# EAGLE design demux (EAGLE 9.4.2)
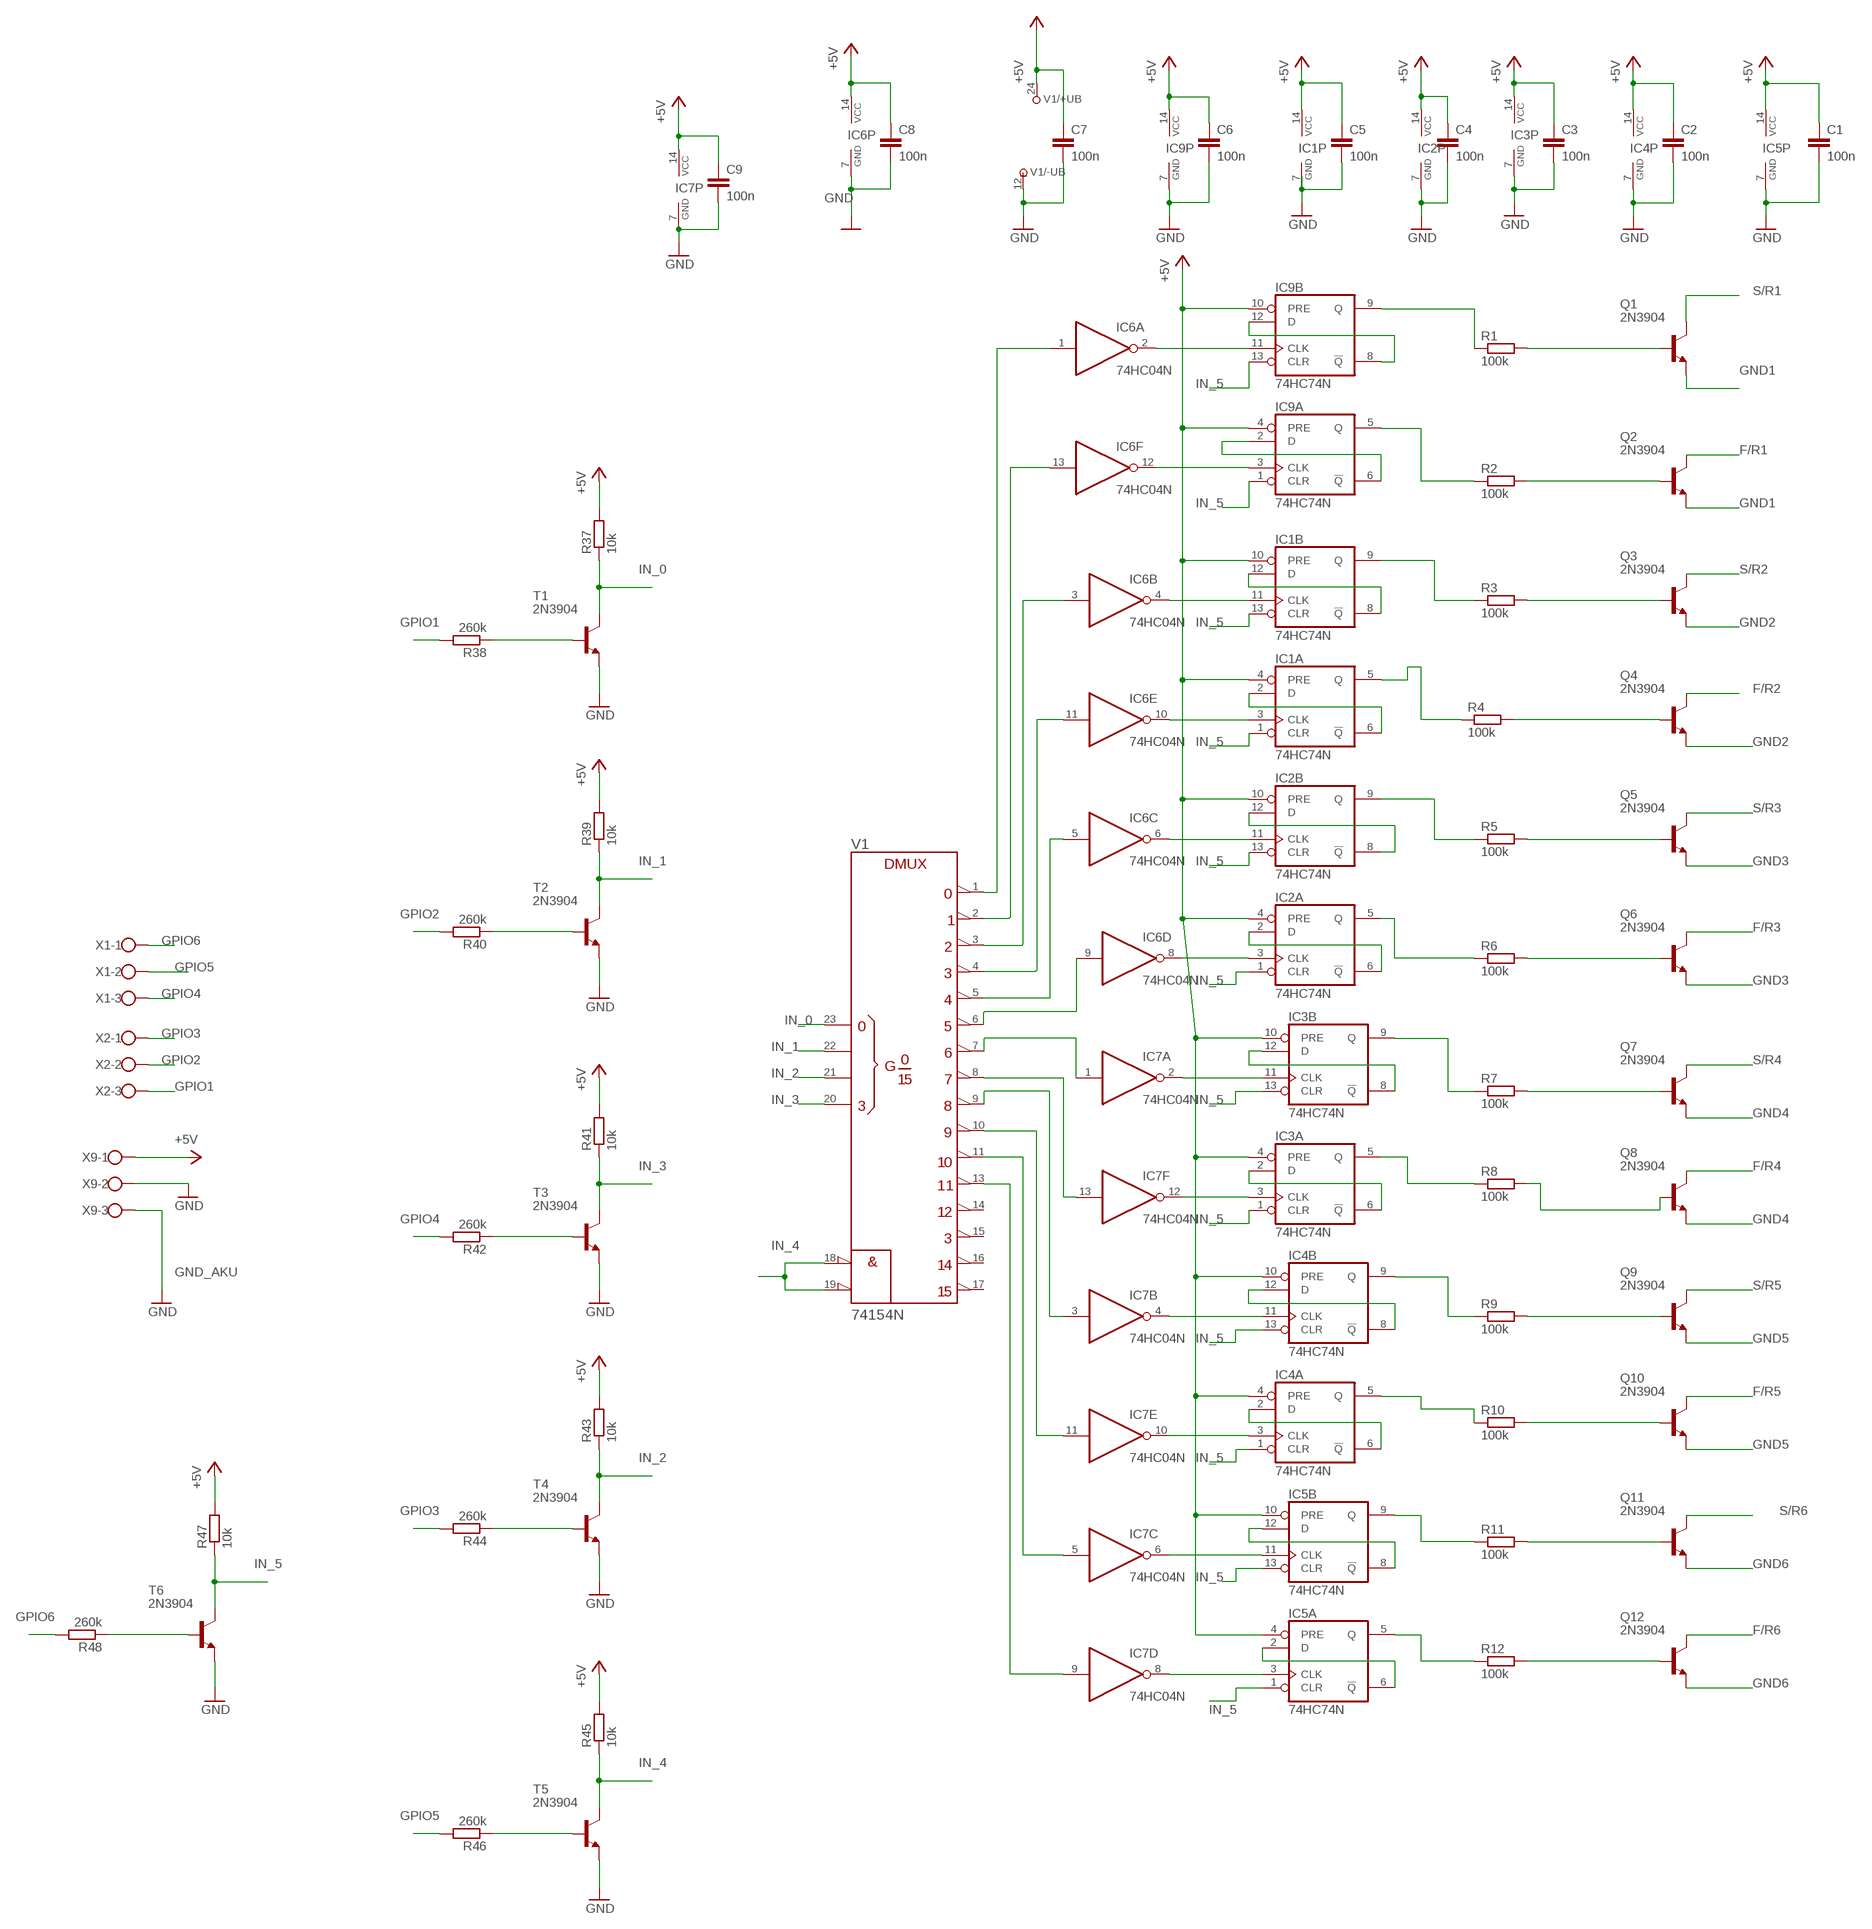
[diagram p0: schematic, sheet 1, part 1 of 2]
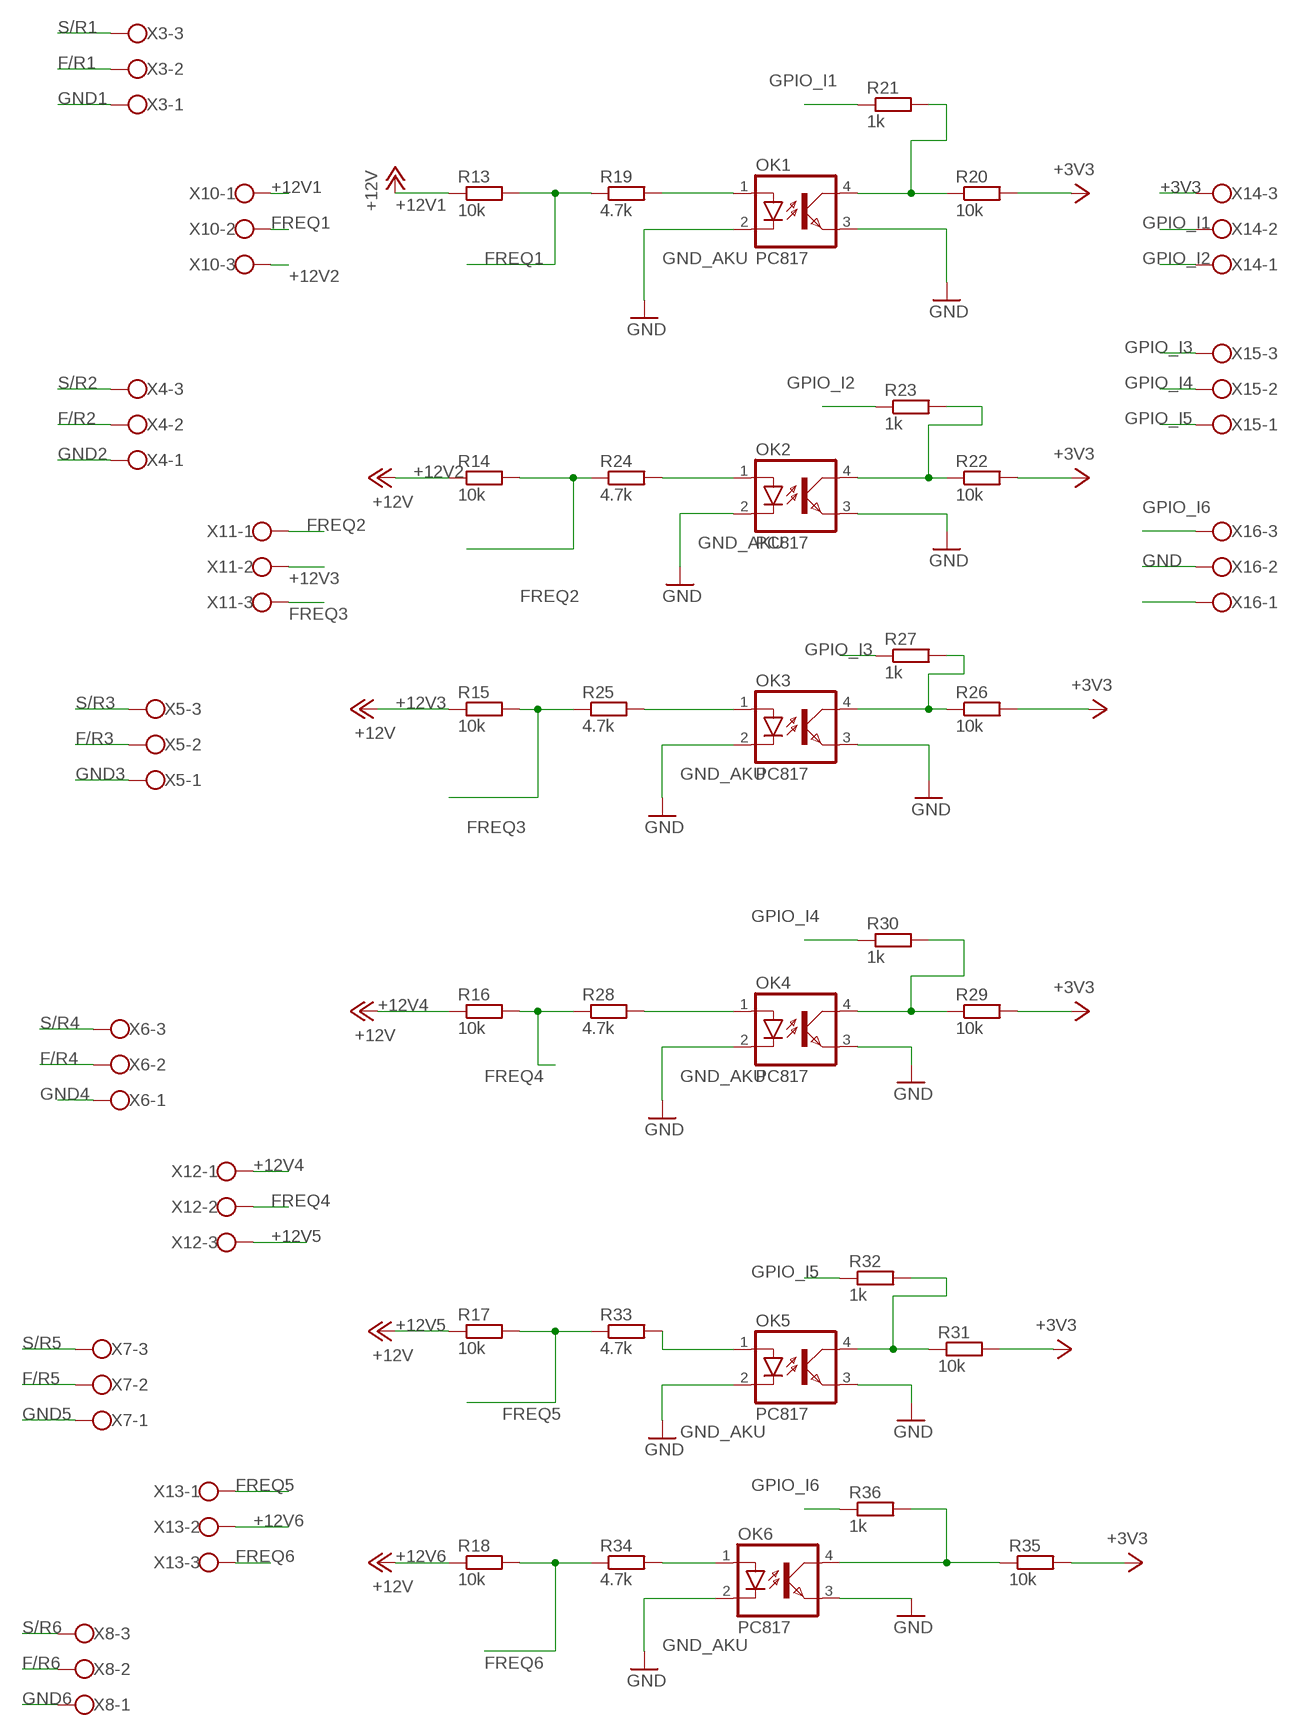
[diagram p1: schematic, sheet 1, part 2 of 2]

## Parts
C1  100n  C-EU025-025X050  [C025-025X050]
C2  100n  C-EU025-025X050  [C025-025X050]
C3  100n  C-EU025-025X050  [C025-025X050]
C4  100n  C-EU025-025X050  [C025-025X050]
C5  100n  C-EU025-025X050  [C025-025X050]
C6  100n  C-EU025-025X050  [C025-025X050]
C7  100n  C-EU025-025X050  [C025-025X050]
C8  100n  C-EU025-025X050  [C025-025X050]
C9  100n  C-EU025-025X050  [C025-025X050]
IC1  74HC74N  [DIL14]
IC2  74HC74N  [DIL14]
IC3  74HC74N  [DIL14]
IC4  74HC74N  [DIL14]
IC5  74HC74N  [DIL14]
IC6  74HC04N  [DIL14]
IC7  74HC04N  [DIL14]
IC9  74HC74N  [DIL14]
OK1  PC817  [DIL04]
OK2  PC817  [DIL04]
OK3  PC817  [DIL04]
OK4  PC817  [DIL04]
OK5  PC817  [DIL04]
OK6  PC817  [DIL04]
Q1  2N3904  [TO92]
Q2  2N3904  [TO92]
Q3  2N3904  [TO92]
Q4  2N3904  [TO92]
Q5  2N3904  [TO92]
Q6  2N3904  [TO92]
Q7  2N3904  [TO92]
Q8  2N3904  [TO92]
Q9  2N3904  [TO92]
Q10  2N3904  [TO92]
Q11  2N3904  [TO92]
Q12  2N3904  [TO92]
R1  100k  R-EU_0309/12  [0309/12]
R2  100k  R-EU_0309/12  [0309/12]
R3  100k  R-EU_0309/12  [0309/12]
R4  100k  R-EU_0309/12  [0309/12]
R5  100k  R-EU_0309/12  [0309/12]
R6  100k  R-EU_0309/12  [0309/12]
R7  100k  R-EU_0309/12  [0309/12]
R8  100k  R-EU_0309/12  [0309/12]
R9  100k  R-EU_0309/12  [0309/12]
R10  100k  R-EU_0309/12  [0309/12]
R11  100k  R-EU_0309/12  [0309/12]
R12  100k  R-EU_0309/12  [0309/12]
R13  10k  R-EU_0309/12  [0309/12]
R14  10k  R-EU_0309/12  [0309/12]
R15  10k  R-EU_0309/12  [0309/12]
R16  10k  R-EU_0309/12  [0309/12]
R17  10k  R-EU_0309/12  [0309/12]
R18  10k  R-EU_0309/12  [0309/12]
R19  4.7k  R-EU_0207/12  [0207/12]
R20  10k  R-EU_0207/12  [0207/12]
R21  1k  R-EU_0207/12  [0207/12]
R22  10k  R-EU_0207/12  [0207/12]
R23  1k  R-EU_0207/12  [0207/12]
R24  4.7k  R-EU_0207/12  [0207/12]
R25  4.7k  R-EU_0207/12  [0207/12]
R26  10k  R-EU_0207/12  [0207/12]
R27  1k  R-EU_0207/12  [0207/12]
R28  4.7k  R-EU_0207/12  [0207/12]
R29  10k  R-EU_0207/12  [0207/12]
R30  1k  R-EU_0207/12  [0207/12]
R31  10k  R-EU_0207/12  [0207/12]
R32  1k  R-EU_0207/12  [0207/12]
R33  4.7k  R-EU_0207/12  [0207/12]
R34  4.7k  R-EU_0207/12  [0207/12]
R35  10k  R-EU_0207/12  [0207/12]
R36  1k  R-EU_0207/12  [0207/12]
R37  10k  R-EU_0207/10  [0207/10]
R38  260k  R-EU_0207/10  [0207/10]
R39  10k  R-EU_0207/10  [0207/10]
R40  260k  R-EU_0207/10  [0207/10]
R41  10k  R-EU_0207/10  [0207/10]
R42  260k  R-EU_0207/10  [0207/10]
R43  10k  R-EU_0207/10  [0207/10]
R44  260k  R-EU_0207/10  [0207/10]
R45  10k  R-EU_0207/10  [0207/10]
R46  260k  R-EU_0207/10  [0207/10]
R47  10k  R-EU_0207/10  [0207/10]
R48  260k  R-EU_0207/10  [0207/10]
T1  2N3904  [TO92]
T2  2N3904  [TO92]
T3  2N3904  [TO92]
T4  2N3904  [TO92]
T5  2N3904  [TO92]
T6  2N3904  [TO92]
V1  74154N  [DIL24-3]
X1  W237-103  [W237-103]
X2  W237-103  [W237-103]
X3  W237-103  [W237-103]
X4  W237-103  [W237-103]
X5  W237-103  [W237-103]
X6  W237-103  [W237-103]
X7  W237-103  [W237-103]
X8  W237-103  [W237-103]
X9  W237-103  [W237-103]
X10  W237-103  [W237-103]
X11  W237-103  [W237-103]
X12  W237-103  [W237-103]
X13  W237-103  [W237-103]
X14  W237-103  [W237-103]
X15  W237-103  [W237-103]
X16  W237-103  [W237-103]

## Nets
+3V3: R20.2 R22.2 R26.2 R29.2 R31.2 R35.2 X14.3
+5V: C1.1 C2.1 C3.1 C4.1 C5.1 C6.1 C7.1 C8.1 C9.1 IC1.4(A:PRE) IC1.10(B:PRE) IC1.14(P:VCC) IC2.4(A:PRE) IC2.10(B:PRE) IC2.14(P:VCC) IC3.4(A:PRE) IC3.10(B:PRE) IC3.14(P:VCC) IC4.4(A:PRE) IC4.10(B:PRE) IC4.14(P:VCC) IC5.4(A:PRE) IC5.10(B:PRE) IC5.14(P:VCC) IC6.14(P:VCC) IC7.14(P:VCC) IC9.4(A:PRE) IC9.10(B:PRE) IC9.14(P:VCC) R37.2 R39.2 R41.2 R43.2 R45.2 R47.2 V1.24(+UB) X9.1
+12V1: R13.1 X10.1 ; supply symbol labelled +12V
+12V2: R14.1 X10.3 ; supply symbol labelled +12V
+12V3: R15.1 X11.2 ; supply symbol labelled +12V
+12V4: R16.1 X12.1 ; supply symbol labelled +12V
+12V5: R17.1 X12.3 ; supply symbol labelled +12V
+12V6: R18.1 X13.2 ; supply symbol labelled +12V
F/R1: Q2.1(C) X3.2
F/R2: Q4.1(C) X4.2
F/R3: Q6.1(C) X5.2
F/R4: Q8.1(C) X6.2
F/R5: Q10.1(C) X7.2
F/R6: Q12.1(C) X8.2
FREQ1: R13.2 R19.1 X10.2
FREQ2: R14.2 R24.1 X11.1
FREQ3: R15.2 R25.1 X11.3
FREQ4: R16.2 R28.1 X12.2
FREQ5: R17.2 R33.1 X13.1
FREQ6: R18.2 R34.1 X13.3
GND: C1.2 C2.2 C3.2 C4.2 C5.2 C6.2 C7.2 C8.2 C9.2 IC1.7(P:GND) IC2.7(P:GND) IC3.7(P:GND) IC4.7(P:GND) IC5.7(P:GND) IC6.7(P:GND) IC7.7(P:GND) IC9.7(P:GND) OK1.3(EMIT) OK2.3(EMIT) OK3.3(EMIT) OK4.3(EMIT) OK5.3(EMIT) OK6.3(EMIT) T1.3(E) T2.3(E) T3.3(E) T4.3(E) T5.3(E) T6.3(E) V1.12(-UB) X9.2 X16.2
GND1: Q1.3(E) Q2.3(E) X3.1
GND2: Q3.3(E) Q4.3(E) X4.1
GND3: Q5.3(E) Q6.3(E) X5.1
GND4: Q7.3(E) Q8.3(E) X6.1
GND5: Q9.3(E) Q10.3(E) X7.1
GND6: Q11.3(E) Q12.3(E) X8.1
GND_AKU: OK1.2(C) OK2.2(C) OK3.2(C) OK4.2(C) OK5.2(C) OK6.2(C) X9.3 ; supply symbol labelled GND
GPIO1: R38.2 X2.3
GPIO2: R40.2 X2.2
GPIO3: R44.2 X2.1
GPIO4: R42.2 X1.3
GPIO5: R46.2 X1.2
GPIO6: R48.2 X1.1
GPIO_I1: R21.1 X14.2
GPIO_I2: R23.1 X14.1
GPIO_I3: R27.1 X15.3
GPIO_I4: R30.1 X15.2
GPIO_I5: R32.1 X15.1
GPIO_I6: R36.1 X16.3
IN_0: R37.1 T1.1(C) V1.23(A)
IN_1: R39.1 T2.1(C) V1.22(B)
IN_2: R43.1 T4.1(C) V1.21(C)
IN_3: R41.1 T3.1(C) V1.20(D)
IN_4: R45.1 T5.1(C) V1.18(!G1) V1.19(!G2)
IN_5: IC1.1(A:CLR) IC1.13(B:CLR) IC2.1(A:CLR) IC2.13(B:CLR) IC3.1(A:CLR) IC3.13(B:CLR) IC4.1(A:CLR) IC4.13(B:CLR) IC5.1(A:CLR) IC5.13(B:CLR) IC9.1(A:CLR) IC9.13(B:CLR) R47.1 T6.1(C)
N$1: IC4.11(B:CLK) IC7.4(B:O)
N$2: IC1.2(A:D) IC1.6(A:!Q)
N$3: IC9.8(B:!Q) IC9.12(B:D)
N$4: IC6.2(A:O) IC9.11(B:CLK)
N$5: IC6.1(A:I) V1.1
N$6: IC3.8(B:!Q) IC3.12(B:D)
N$7: IC3.2(A:D) IC3.6(A:!Q)
N$8: IC2.8(B:!Q) IC2.12(B:D)
N$9: IC5.2(A:D) IC5.6(A:!Q)
N$10: IC7.11(E:I) V1.10
N$11: IC4.3(A:CLK) IC7.10(E:O)
N$12: IC6.12(F:O) IC9.3(A:CLK)
N$13: IC5.3(A:CLK) IC7.8(D:O)
N$14: IC9.2(A:D) IC9.6(A:!Q)
N$15: IC1.11(B:CLK) IC6.4(B:O)
N$16: IC5.11(B:CLK) IC7.6(C:O)
N$17: IC3.11(B:CLK) IC7.2(A:O)
N$18: IC2.2(A:D) IC2.6(A:!Q)
N$19: IC3.3(A:CLK) IC7.12(F:O)
N$20: IC4.2(A:D) IC4.6(A:!Q)
N$21: IC1.8(B:!Q) IC1.12(B:D)
N$22: IC2.3(A:CLK) IC6.8(D:O)
N$23: IC2.11(B:CLK) IC6.6(C:O)
N$24: IC1.3(A:CLK) IC6.10(E:O)
N$25: IC6.13(F:I) V1.2
N$26: IC6.3(B:I) V1.3
N$27: IC6.11(E:I) V1.4
N$28: IC6.5(C:I) V1.5
N$29: IC6.9(D:I) V1.6
N$30: IC7.1(A:I) V1.7
N$31: IC7.13(F:I) V1.8
N$32: IC4.8(B:!Q) IC4.12(B:D)
N$33: IC5.8(B:!Q) IC5.12(B:D)
N$34: IC7.5(C:I) V1.11
N$35: IC7.9(D:I) V1.13
N$37: IC9.9(B:Q) R1.1
N$38: Q1.2(B) R1.2
N$39: Q2.2(B) R2.2
N$40: IC9.5(A:Q) R2.1
N$41: IC1.9(B:Q) R3.1
N$42: Q3.2(B) R3.2
N$43: Q4.2(B) R4.2
N$44: IC1.5(A:Q) R4.1
N$45: IC2.9(B:Q) R5.1
N$46: Q5.2(B) R5.2
N$47: Q6.2(B) R6.2
N$48: IC2.5(A:Q) R6.1
N$49: IC3.9(B:Q) R7.1
N$50: Q7.2(B) R7.2
N$51: Q8.2(B) R8.2
N$52: IC3.5(A:Q) R8.1
N$53: IC4.9(B:Q) R9.1
N$54: Q9.2(B) R9.2
N$55: Q10.2(B) R10.2
N$56: IC4.5(A:Q) R10.1
N$57: IC5.9(B:Q) R11.1
N$58: Q11.2(B) R11.2
N$59: Q12.2(B) R12.2
N$60: IC5.5(A:Q) R12.1
N$61: OK1.1(A) R19.2
N$62: OK1.4(COL) R20.1 R21.2
N$63: R40.1 T2.2(B)
N$64: OK6.4(COL) R35.1 R36.2
N$65: OK5.4(COL) R31.1 R32.2
N$66: OK4.4(COL) R29.1 R30.2
N$67: OK3.4(COL) R26.1 R27.2
N$68: OK2.4(COL) R22.1 R23.2
N$69: OK2.1(A) R24.2
N$70: R38.1 T1.2(B)
N$71: OK3.1(A) R25.2
N$72: X16.1
N$73: R42.1 T3.2(B)
N$74: OK4.1(A) R28.2
N$75: R44.1 T4.2(B)
N$76: OK5.1(A) R33.2
N$77: R46.1 T5.2(B)
N$78: OK6.1(A) R34.2
N$79: R48.1 T6.2(B)
N$82: IC7.3(B:I) V1.9
S/R1: Q1.1(C) X3.3
S/R2: Q3.1(C) X4.3
S/R3: Q5.1(C) X5.3
S/R4: Q7.1(C) X6.3
S/R5: Q9.1(C) X7.3
S/R6: Q11.1(C) X8.3
Unconnected: V1.14 V1.15 V1.16 V1.17

## Library data of the parts
C1-C9 = rcl:C-EU: CAPACITOR, European symbol; SPICEPREFIX: C
IC1-IC5 IC9 = 74xx-eu:74*74: Dual D type positive edge triggered FLIP FLOP, preset and clear
IC6 IC7 = 74xx-eu:74*04: Hex INVERTER
OK1-OK6 = optocoupler:PC817: SHARP OPTO COUPLER; MPN: PC817X4J000F; OC_FARNELL: 9707727; OC_NEWARK: 97K7059
Q1-Q12 = transistor-npn:2N3904: NPN Transistor
R1-R48 = rcl:R-EU_: RESISTOR, European symbol; SPICEPREFIX: R
T1-T6 = transistor-neu-to92:2N3904: NPN TRANSISTOR
V1 = 74ttl-din:74*154: 4-line to 16-line data SELECTOR/MULTIPLEXER
X1-X16 = con-wago-500:W237-103: WAGO SCREW CLAMP; MPN: 237-103; OC_FARNELL: unknown; OC_NEWARK: 18M7116

## Board
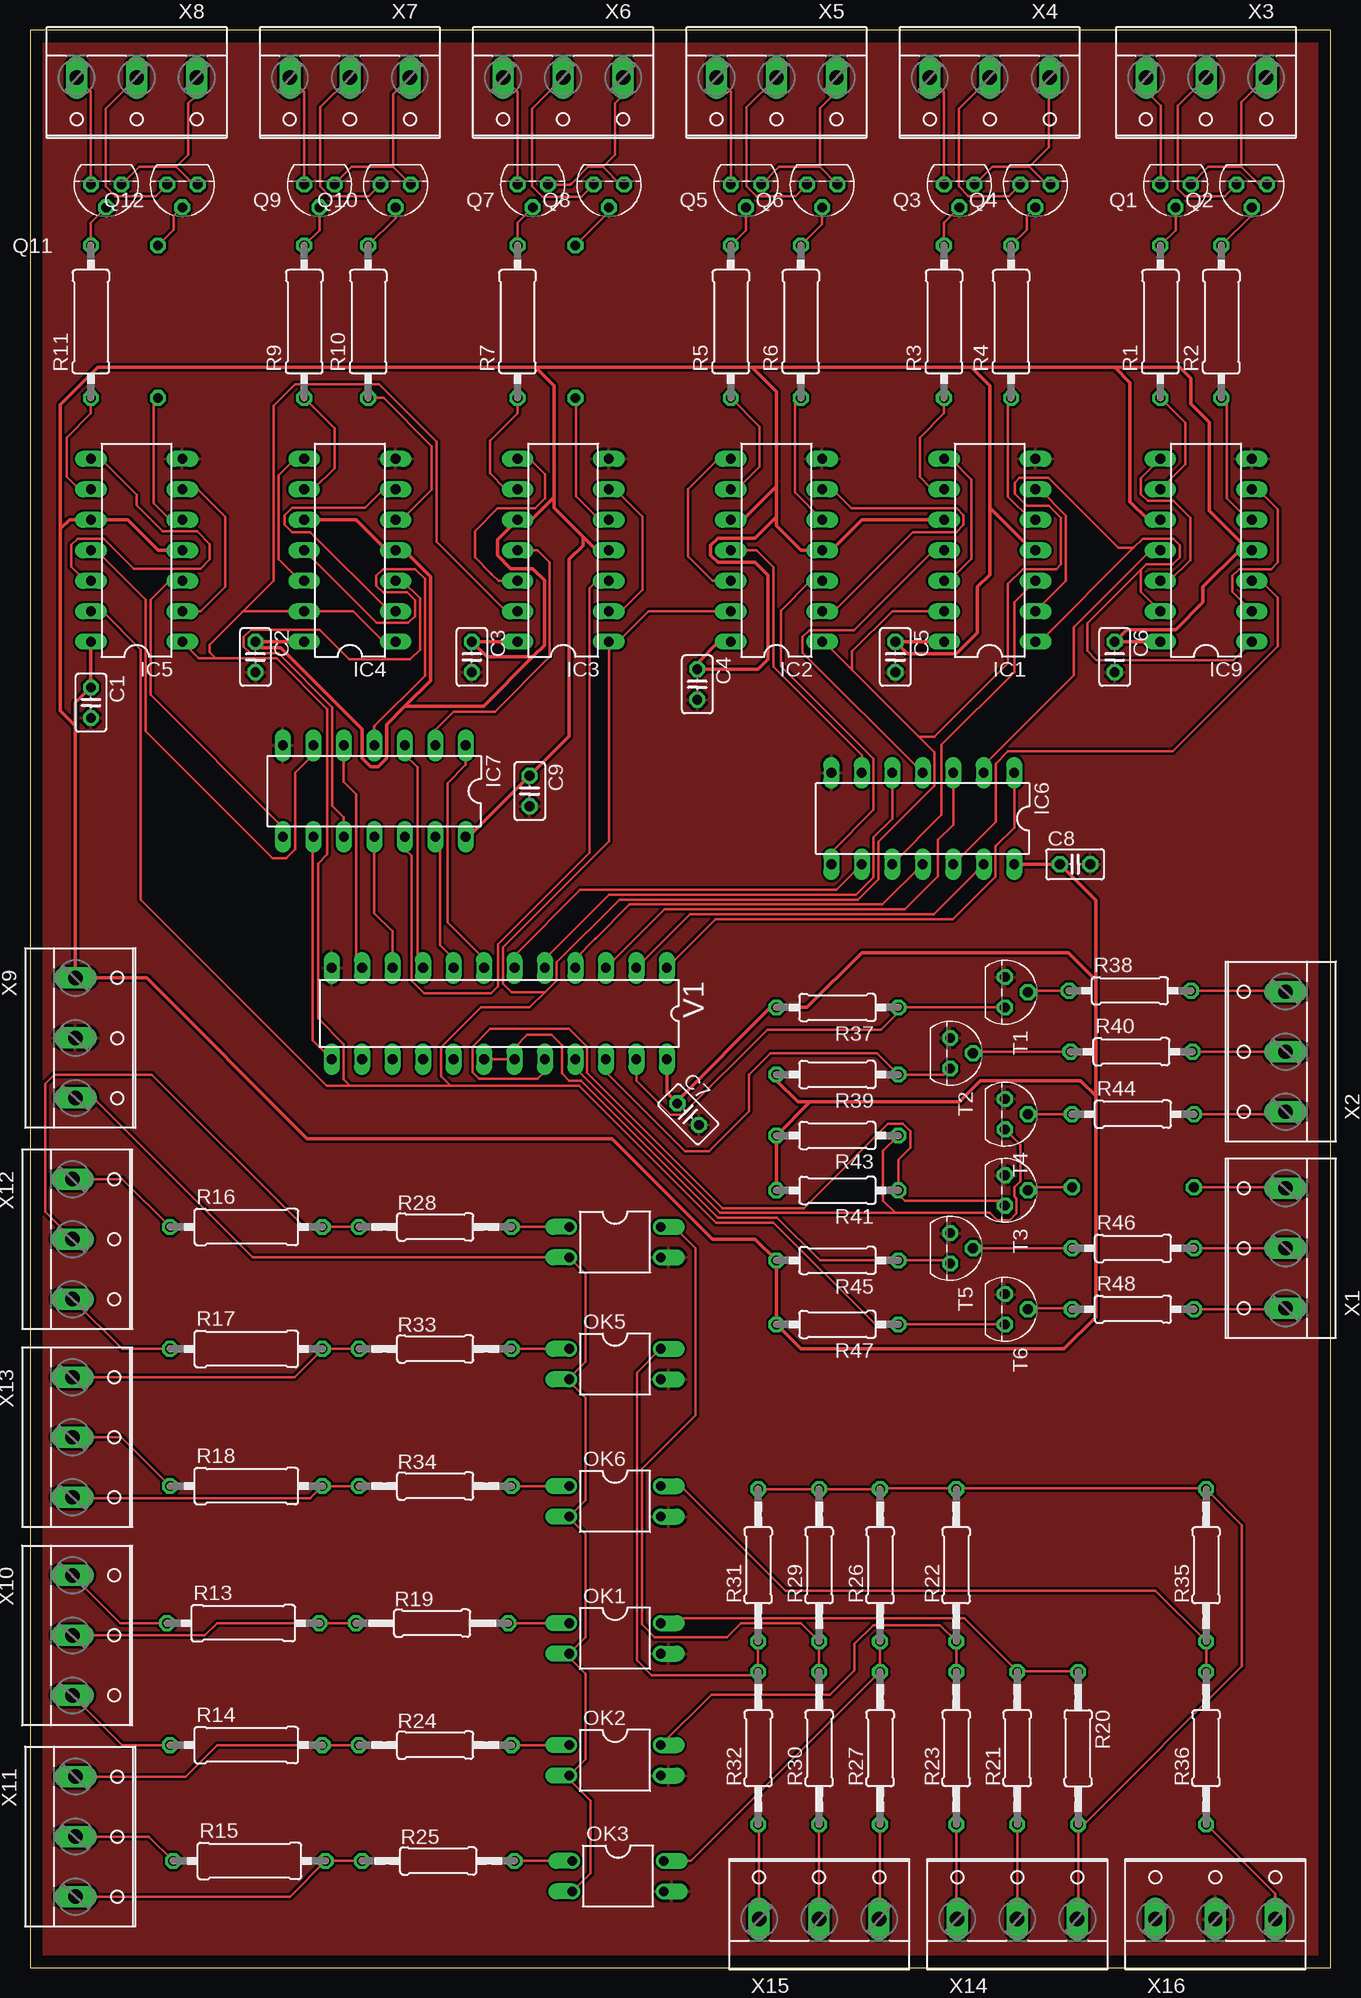
[diagram p2: board, top side]
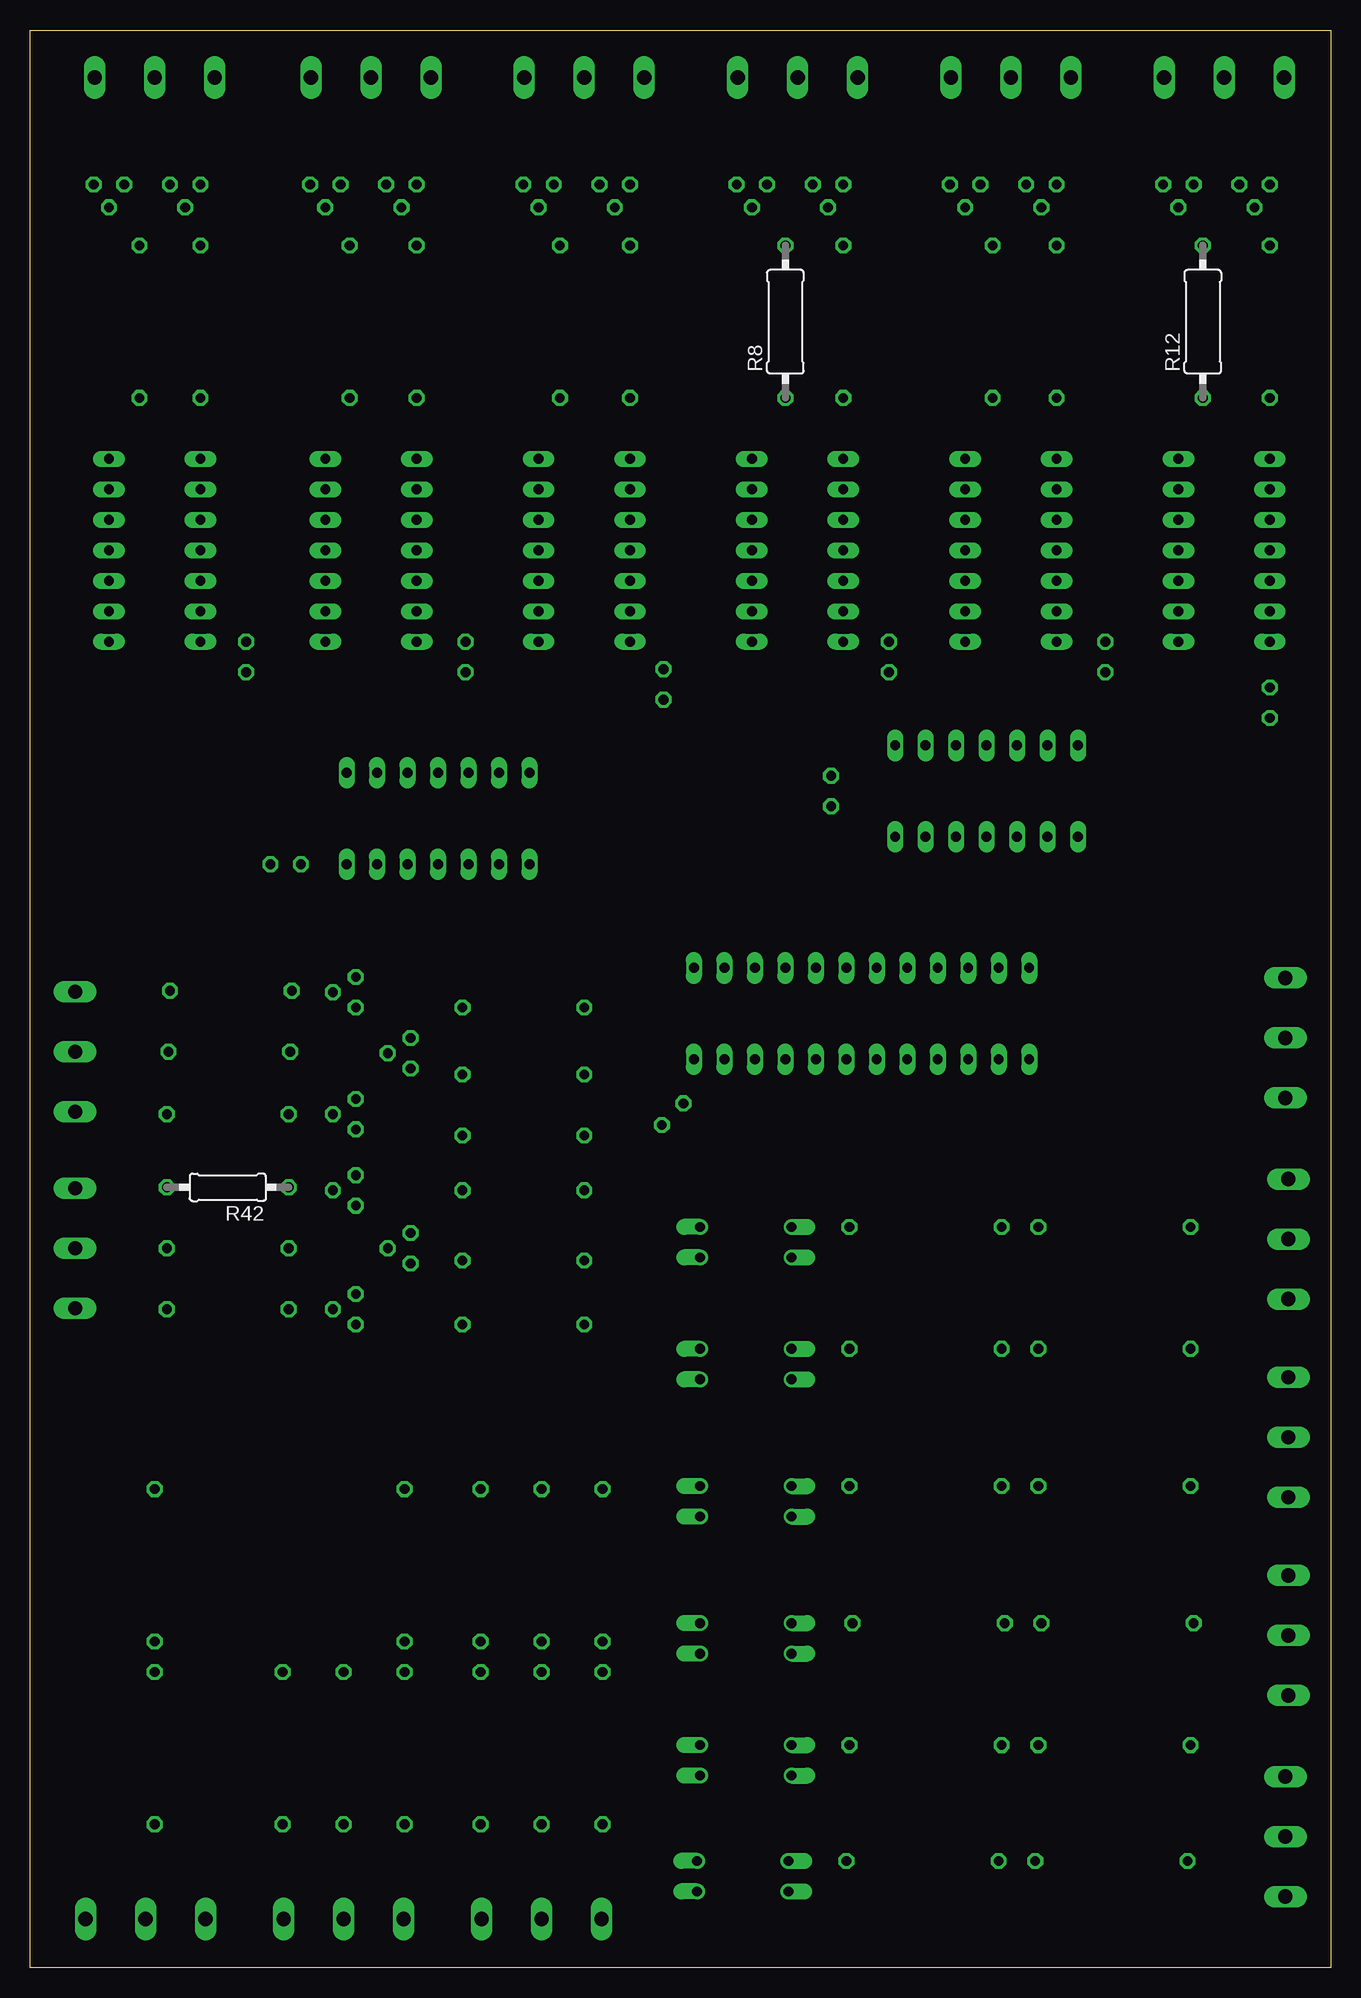
[diagram p3: board, bottom side, seen from below]

Size 108.44 x 161.47 mm. Coordinates in mm from the lower left corner, seen from the top.
Outline: 0,0 108.44,0 108.44,161.47 0,161.47 0,0
Copper layers (1*16): Top 0.035mm / dielectric 1.5mm / Bottom 0.035mm
Design rules "default *": minimum track width 8mil, minimum drill 0.35mm, track to track 8mil, track to pad 8mil, pad to pad 8mil, via to via 8mil, smd to smd 8mil, copper to edge 40mil, drill to drill 8mil, minimum pad ring 10mil, minimum via ring 8mil, stop-mask expansion 4mil, vias tented up to drill 0mil, thermal gap 10mil

### Footprints (pad centres in the part's own frame; a part is rotated, then mirrored left to right if it is on the bottom)
C025-025X050 = drill 0.813 octagon: 1 -1.27,0; 2 1.27,0
DIL14 = drill 0.813 long: 1 -7.62,-3.81; 2 -5.08,-3.81; 3 -2.54,-3.81; 4 0,-3.81; 5 2.54,-3.81; 6 5.08,-3.81; 7 7.62,-3.81; 8 7.62,3.81; 9 5.08,3.81; 10 2.54,3.81; 11 0,3.81; 12 -2.54,3.81; 13 -5.08,3.81; 14 -7.62,3.81
DIL04 = drill 0.813 offset: 1 -1.27,-3.81; 2 1.27,-3.81; 3 1.27,3.81; 4 -1.27,3.81
TO92 = drill 0.813 octagon: 1 1.27,0; 2 0,1.905; 3 -1.27,0
0309/12 = drill 0.813 octagon: 1 -6.35,0; 2 6.35,0
0207/12 = drill 0.813 octagon: 1 -6.35,0; 2 6.35,0
0207/10 = drill 0.813 octagon: 1 -5.08,0; 2 5.08,0
DIL24-3 = drill 0.813 long: 1 -13.97,-3.81; 2 -11.43,-3.81; 3 -8.89,-3.81; 4 -6.35,-3.81; 5 -3.81,-3.81; 6 -1.27,-3.81; 7 1.27,-3.81; 8 3.81,-3.81; 9 6.35,-3.81; 10 8.89,-3.81; 11 11.43,-3.81; 12 13.97,-3.81; 13 13.97,3.81; 14 11.43,3.81; 15 8.89,3.81; 16 6.35,3.81; 17 3.81,3.81; 18 1.27,3.81; 19 -1.27,3.81; 20 -3.81,3.81; 21 -6.35,3.81; 22 -8.89,3.81; 23 -11.43,3.81; 24 -13.97,3.81
W237-103 = drill 1.194 long: 1 -5,-1.29; 2 0,-1.29; 3 5,-1.29

### Placement (x,y rotation side)
C1  5.08,105.41 270 top
C2  18.8,109.22 270 top
C3  36.83,109.22 270 top
C4  55.63,106.93 270 top
C5  72.14,109.22 270 top
C6  90.42,109.22 270 top
C7  54.86,71.12 315 top
C8  87.12,91.95 0 top
C9  41.66,98.04 270 top
IC1  80.01,118.11 90 top
IC2  62.23,118.11 90 top
IC3  44.45,118.11 90 top
IC4  26.67,118.11 90 top
IC5  8.89,118.11 90 top
IC6  74.42,95.76 180 top
IC7  28.7,98.04 180 top
IC9  98.04,118.11 90 top
OK1  48.77,27.43 270 top
OK2  48.77,17.27 270 top
OK3  49.02,7.62 270 top
OK4  48.77,60.45 270 top
OK5  48.77,50.29 270 top
OK6  48.77,38.86 270 top
Q1  95.5,148.59 180 top
Q2  101.85,148.59 180 top
Q3  77.47,148.59 180 top
Q4  83.82,148.59 180 top
Q5  59.69,148.59 180 top
Q6  66.04,148.59 180 top
Q7  41.91,148.59 180 top
Q8  48.26,148.59 180 top
Q9  24.13,148.59 180 top
Q10  30.48,148.59 180 top
Q11  6.35,148.59 180 top
Q12  12.7,148.59 180 top
R1  94.23,137.16 90 top
R2  99.31,137.16 90 top
R3  76.2,137.16 90 top
R4  81.79,137.16 90 top
R5  58.42,137.16 90 top
R6  64.26,137.16 90 top
R7  40.64,137.16 90 top
R8  45.47,137.16 90 bottom
R9  22.86,137.16 90 top
R10  28.19,137.16 90 top
R11  5.08,137.16 90 top
R12  10.67,137.16 90 bottom
R13  17.78,28.7 0 top
R14  18.03,18.54 0 top
R15  18.29,8.89 0 top
R16  18.03,61.72 0 top
R17  18.03,51.56 0 top
R18  18.03,40.13 0 top
R19  33.53,28.7 0 top
R20  87.38,18.29 270 top
R21  82.3,18.29 90 top
R22  77.22,33.53 90 top
R23  77.22,18.29 90 top
R24  33.78,18.54 0 top
R25  34.04,8.89 0 top
R26  70.87,33.53 90 top
R27  70.87,18.29 90 top
R28  33.78,61.72 0 top
R29  65.79,33.53 90 top
R30  65.79,18.29 90 top
R31  60.71,33.53 90 top
R32  60.71,18.29 90 top
R33  33.78,51.56 0 top
R34  33.78,40.13 0 top
R35  98.04,33.53 90 top
R36  98.04,18.29 90 top
R37  67.31,80.01 180 top
R38  91.69,81.41 0 top
R39  67.31,74.42 180 top
R40  91.82,76.33 0 top
R41  67.31,64.77 180 top
R42  91.95,65.02 180 bottom
R43  67.31,69.34 180 top
R44  91.95,71.12 0 top
R45  67.31,58.93 180 top
R46  91.95,59.94 0 top
R47  67.31,53.59 180 top
R48  91.95,54.86 0 top
T1  81.28,81.28 270 top
T2  76.71,76.2 270 top
T3  81.28,64.77 270 top
T4  81.28,71.12 270 top
T5  76.71,59.94 270 top
T6  81.28,54.86 270 top
V1  39.12,79.5 180 top
X1  103.38,59.94 90 top
X2  103.38,76.33 90 top
X3  98.04,156.21 180 top
X4  80.01,156.21 180 top
X5  62.23,156.21 180 top
X6  44.45,156.21 180 top
X7  26.67,156.21 180 top
X8  8.89,156.21 180 top
X9  5.08,77.47 270 top
X10  4.83,27.69 270 top
X11  5.08,10.92 270 top
X12  4.83,60.71 270 top
X13  4.83,44.2 270 top
X14  82.3,5.33 0 top
X15  65.79,5.33 0 top
X16  98.81,5.33 0 top

### Tracks (layer width: path | path; a pad name or v marks a point on that pad's centre or on a via)
+3V3
  Top 0.203: 77.22,39.93 97.99,39.93 R35.2 101.04,36.88 101.04,25.09 87.88,11.94 R20.2 87.38,4.17 87.3,4.09 X14.3 | 77.22,39.93 R22.2 | 77.22,39.93 70.92,39.93 R26.2 R29.2 R31.2
+5V
  Top 0.305: 3.79,103.5 X9.1 9.73,82.47 23.11,69.09 48.51,69.09 56.9,60.71 60.45,60.71 R45.2 R47.2 64.26,51.56 86.21,51.56 88.85,54.2 88.85,72.64 | 3.79,103.5 2.54,104.75 2.54,119.89 | 3.79,103.5 3.79,105.39 C1.1 IC5.14 | 65.02,72.14 77.47,72.14 79.25,73.91 87.58,73.91 88.85,72.64 | R41.2 R43.2 65.02,72.14 | 65.02,72.14 64.01,72.14 62.23,73.91 R39.2 | 88.85,72.64 88.85,82.3 | 88.85,82.3 88.85,88.95 C8.1 IC6.14 | 88.85,82.3 86.56,84.58 69.34,84.58 64.77,80.01 R37.2 61.72,80.01 53.97,72.25 C7.1 53.09,72.9 V1.24 | 2.54,119.89 3.3,120.65 IC5.10 8.13,120.65 10.67,118.11 IC5.4 | 2.54,119.89 2.54,130.25 5.64,133.35 42.16,133.35 | 42.16,133.35 43.69,131.83 43.69,122.54 | 43.69,122.54 41.8,120.65 IC3.10 38.96,118.97 38.96,117.69 40.07,116.59 41.91,116.59 42.88,115.62 42.88,110.19 41.91,109.22 | 43.69,122.54 43.69,121.67 46.1,119.25 | IC3.4 47.24,118.11 46.1,119.25 | 46.1,119.25 46.1,118.49 44.96,117.35 44.96,102.62 C9.1 36.58,94.23 IC7.14 | 41.91,109.22 38.1,109.22 C3.1 IC3.14 | 41.91,109.22 37.8,105.1 31.24,105.1 | 31.24,105.1 29.72,103.58 29.72,100.77 29.02,100.08 28.38,100.08 27.69,100.77 27.69,103.2 20.9,109.98 19.3,109.98 C2.1 IC4.14 | IC4.10 27.18,120.65 29.72,118.11 IC4.4 31.18,118.11 33.38,115.91 33.38,107.24 31.24,105.1 | 42.16,133.35 60.2,133.35 | 60.2,133.35 78.49,133.35 | 78.49,133.35 90.42,133.35 | 90.42,133.35 95.86,133.35 96.77,132.44 96.77,130.3 98.3,128.78 98.3,121.41 101.6,118.11 IC9.4 100.84,118.11 97.79,115.06 97.79,113.79 95.5,111.51 91.44,111.51 C6.1 IC9.14 | 60.2,133.35 62.23,131.32 62.23,123.44 | 62.23,123.44 62.23,120.9 | 62.23,123.44 59.44,120.65 IC2.10
  Top 0.305: 62.23,120.9 60.45,119.13 57.34,119.13 56.74,118.53 56.74,117.69 57.34,117.09 60.45,117.09 61.52,116.03 61.52,109.02 60.71,108.2 C4.1 55.63,108.71 57.4,110.49 IC2.14 | IC1.10 69.34,120.65 66.8,118.11 IC2.4 64.26,118.11 62.23,120.14 62.23,120.9 | 78.49,133.35 80.01,131.83 80.01,121.67 | IC1.4 83.57,118.11 80.01,121.67 | 80.01,121.67 80.01,116.08 78.99,115.06 78.99,111.25 77.22,109.47 73.15,109.47 C5.1 IC1.14 | IC9.10 93.22,120.65 91.69,122.17 91.69,132.08 90.42,133.35
+12V1
  Top 0.203: X10.1 7.52,28.7 R13.1
+12V2
  Top 0.203: X10.3 7.68,18.54 R14.1
+12V3
  Top 0.203: X11.2 9.91,10.92 R15.1
+12V4
  Top 0.203: X12.1 7.7,65.71 R16.1
+12V5
  Top 0.203: R17.1 7.68,51.56 X12.3
+12V6
  Top 0.203: X13.2 7.62,44.2 R18.1
F/R1
  Top 0.203: Q2.1 99.62,147.62 96.32,147.62 95.71,148.23 95.71,155.16 X3.2
F/R2
  Top 0.203: Q4.1 81.58,147.62 78.23,147.62 77.42,148.44 77.42,154.91 X4.2
F/R3
  Top 0.203: Q6.1 63.8,147.62 60.55,147.62 59.74,148.44 59.74,155.01 X5.2
F/R4
  Top 0.203: X6.2 41.86,154.91 41.86,148.44 42.72,147.57 45.97,147.57 Q8.1
F/R5
  Top 0.203: Q10.1 28.25,147.62 24.99,147.62 24.18,148.44 24.18,155.01 X7.2
F/R6
  Top 0.203: Q12.1 10.46,147.62 7.11,147.62 6.3,148.44 6.3,154.91 X8.2
FREQ1
  Top 0.203: R19.1 R13.2 15.6,28.7 14.58,27.69 X10.2
FREQ2
  Top 0.203: R24.1 R14.2 15.6,18.54 12.98,15.92 X11.1
FREQ3
  Top 0.203: X11.3 21.67,5.92 R15.2 R25.1
FREQ4
  Top 0.203: R28.1 R16.2 22.86,61.72 10.16,74.42 2.03,74.42 1.27,73.66 1.27,62.97 X12.2
FREQ5
  Top 0.203: X13.1 22.07,49.2 24.38,51.51 R17.2 R33.1
FREQ6
  Top 0.203: X13.3 3.62,39.12 23.37,39.12 R18.2 R34.1
GND
  pour Top: -1.27,163.83 -1.52,-3.81 110.49,-3.81 110.49,163.83
GND1
  Top 0.203: 100.99,150.06 98.25,150.06 Q1.3 | 100.99,150.06 100.99,155.45 X3.1 | Q2.3 102.46,148.59 100.99,150.06
GND2
  Top 0.203: 83.31,150.06 84.94,148.44 Q4.3 | 83.31,150.06 80.21,150.06 Q3.3 | X4.1 84.94,157.43 84.94,151.69 83.31,150.06
GND3
  Top 0.203: Q6.3 65.84,150.06 | 65.84,150.06 65.84,154.94 67.23,156.33 X5.1 | 65.84,150.06 62.43,150.06 Q5.3
GND4
  Top 0.203: 47.75,150.06 46.53,150.06 45.14,148.67 45.11,148.64 45.06,148.59 Q7.3 | 47.75,150.06 48.77,151.08 48.77,155.35 49.45,156.03 X6.1 | Q8.3 49.23,148.59 47.75,150.06
GND5
  Top 0.203: 30.28,150.06 26.82,150.06 25.4,148.64 Q9.3 | Q10.3 30.28,150.06 | 30.28,150.06 30.28,156.11 X7.1
GND6
  Top 0.203: 12.19,150.06 13.82,148.44 Q12.3 | 12.19,150.06 13.21,151.08 13.21,155.35 13.77,155.91 13.82,155.96 13.89,156.03 X8.1 | 12.19,150.06 9.09,150.06 Q11.3
GND_AKU
  Top 0.203: X9.3 5.25,72.47 18.54,59.18 OK4.2 46.33,57.81 46.33,50.49 44.96,49.12 OK5.2 44.96,48.87 46.33,47.5 46.33,38.96 OK6.2 44.96,37.49 46.33,36.12 46.33,27.53 OK1.2 44.96,25.86 46.33,24.49 46.33,17.37 OK2.2 44.96,15.7 46.74,13.92 46.74,7.87 OK3.2
GPIO1
  Top 0.203: X2.3 104.59,81.41 R38.2
GPIO2
  Top 0.203: X2.2 R40.2
GPIO3
  Top 0.203: R44.2 104.46,71.12 X2.1
GPIO4
  Top 0.203: R42.2 104.59,65.02 X1.3
GPIO5
  Top 0.203: R46.2 X1.2
GPIO6
  Top 0.203: X1.1 104.59,54.86 R48.2
GPIO_I1
  Top 0.203: X14.2 R21.1
GPIO_I2
  Top 0.203: X14.1 77.3,4.09 77.22,4.17 R23.1
GPIO_I3
  Top 0.203: X15.3 70.87,4.12 R27.1
GPIO_I4
  Top 0.203: X15.2 R30.1
GPIO_I5
  Top 0.203: X15.1 60.79,11.86 R32.1
GPIO_I6
  Top 0.203: X16.3 103.81,6.18 R36.1
IN_0
  Top 0.203: T1.1 R37.1 72.39,79.6 70.94,78.16 61.47,78.16 54.37,71.05 53.41,71.05 50.55,73.91 V1.23
IN_1
  Top 0.203: T2.1 76.2,74.42 R39.1 70.61,76.2 61.72,76.2 59.94,74.42 59.94,71.37 56.62,68.05 54.59,68.05 48.01,74.62 V1.22
IN_2
  Top 0.203: T4.1 82.55,68.58 82.55,65.53 82.04,65.02 82.04,64.26 82.25,64.06 82.25,62.85 81.68,62.28 80.63,62.28 80.02,62.89 72.14,62.89 | R43.1 71.12,68.07 71.12,63.91 72.14,62.89 | V1.21 45.47,74.97 57.54,62.89 72.14,62.89
IN_3
  Top 0.203: V1.20 42.93,74.68 42.32,74.07 37.45,74.07 36.88,74.63 36.88,76.75 38.36,78.23 44.95,78.23 46.43,76.75 46.43,74.57 57.71,63.3 64.52,63.3 71.53,70.31 72.79,70.31 73.41,69.69 73.41,68.33 72.39,67.31 R41.1 72.39,64.47 72.95,63.91 80.87,63.91 T3.1
IN_4
  Top 0.203: V1.18 V1.19 40.44,75.69 40.44,76.71 41.45,77.72 43.48,77.72 44.35,76.86 44.35,74.52 44.96,73.91 45.94,73.91 57.37,62.48 62.28,62.48 65.84,58.93 R45.1 76.45,58.93 T5.1
IN_5
  Top 0.203: 92,118.31 92.76,119.07 95.29,119.07 95.86,118.51 95.86,117.55 95.25,116.94 93.07,116.94 92.61,116.48 | 35.05,73.51 26.67,73.51 | 74.12,102.56 75.39,101.3 75.39,98.51 70.71,93.83 70.71,90.71 69,89 49.13,89 43.89,83.76 43.89,82.25 42.92,81.28 | 74.12,102.56 68.53,108.15 | T6.1 R47.1 70.46,53.59 61.98,62.08 57.2,62.08 45.77,73.51 35.05,73.51 | IC4.1 29.46,110.49 26.92,113.03 IC4.13 17.78,113.03 | 17.78,113.03 20.32,115.57 20.32,130.15 22.1,131.93 29.11,131.93 33.88,127.15 33.88,118.82 39.67,113.03 IC3.13 | 74.12,102.56 75.39,102.56 81.53,108.71 81.53,115.31 82.76,116.53 85.55,116.53 85.95,116.94 85.95,120.8 84.94,121.82 83.11,121.82 82.09,122.83 82.09,123.75 82.5,124.16 84.89,124.16 90.73,118.31 92,118.31 | 68.53,108.15 66.19,110.49 IC2.1 | 68.53,108.15 68.53,109.68 71.88,113.03 IC1.13 | 26.67,73.51 24.74,73.51 9.25,89 9.25,109.83 6.04,113.03 IC5.13 | 26.67,73.51 26.16,74.02 26.16,76.96 24.03,79.1 24.03,92 24.79,92.76 24.79,104.87 20.54,109.12 15.49,109.12 | IC9.1 100.33,108.97 88.9,108.97 88.14,109.73 88.14,112.01 92.61,116.48 | IC5.1 14.07,109.12 15.49,109.12 | 17.78,113.03 14.99,110.24 14.99,109.63 15.49,109.12 | IC2.13 51.56,113.03 49.02,110.49 IC3.1 48.26,93.88 39.42,85.04 39.42,81.99 40.13,81.28 42.92,81.28 | IC9.13 92.61,114.66 92.61,116.48 | 35.05,73.51 34.29,74.27 34.29,76.71 37.59,80.01 41.65,80.01 42.92,81.28 | IC1.1 84.18,110.49 92,118.31
N$1
  Top 0.203: IC4.11 28.91,112.06 31.54,112.06 32.11,112.63 32.11,113.93 31.43,114.6 29.42,114.6 28.85,115.17 28.85,115.97 29.42,116.53 32.11,116.53 32.92,115.72 32.92,107.64 28.7,103.43 IC7.4
N$2
  Top 0.203: IC1.6 84.18,123.19 86.36,121.01 86.36,115.57 IC1.2
N$3
  Top 0.203: IC9.8 92.61,124.1 92.61,122.79 93.17,122.22 95.3,122.22 96.72,120.8 96.72,117.3 95,115.57 IC9.12
N$4
  Top 0.203: IC9.11 93.42,118.11 87.02,111.71 87.02,107.7 79.5,100.18 IC6.2
N$5
  Top 0.203: IC6.1 82.04,95 80.52,93.47 80.47,93.42 80.47,90.89 76.95,87.38 57.15,87.38 V1.1
N$6
  Top 0.203: IC3.8 41.66,125.73 42.93,124.46 42.93,122.43 42.11,121.61 39,121.61 37.08,119.7 37.08,117.53 38.45,116.17 38.49,116.13 39.05,115.57 IC3.12
N$7
  Top 0.203: IC3.2 49.28,113.03 51.05,114.81 51.05,120.9 48.77,123.19 IC3.6
N$8
  Top 0.203: IC2.12 56.9,115.57 54.86,117.6 54.86,123.19 57.4,125.73 IC2.8
N$9
  Top 0.203: IC5.6 13.97,123.19 16.26,120.9 16.26,115.06 14.22,113.03 IC5.2
N$10
  Top 0.203: V1.10 30.23,86.36 28.7,87.88 IC7.11
N$11
  Top 0.203: IC7.10 26.16,95.86 25.2,96.83 25.2,105.04 20.71,109.53 18.4,109.53 17.83,110.09 17.83,110.89 18.45,111.51 24.13,111.51 26.62,109.02 31.7,109.02 32.51,109.83 32.51,114.1 31.04,115.57 IC4.3
N$12
  Top 0.203: IC6.12 80.52,95.5 80.52,100.33 81.53,101.35 95.25,101.35 104.04,110.13 104.04,114.15 102.62,115.57 IC9.3
N$13
  Top 0.203: IC5.3 11.63,115.57 10.06,114 10.06,106.07 21.08,95.05 IC7.8
N$14
  Top 0.203: IC9.2 100.23,114.66 100.23,115.97 100.79,116.53 103.48,116.53 104.04,117.09 104.04,121.51 102.36,123.19 IC9.6
N$15
  Top 0.203: IC1.11 76.2,117.96 75.18,117.96 68.68,111.45 64.98,111.45 64.41,110.89 64.41,109.58 IC6.4
N$16
  Top 0.203: IC5.11 5.54,118.11 9.65,114 9.65,103.02 20.22,92.46 21.34,92.46 22.1,93.22 22.1,99.57 23.62,101.09 IC7.6
N$17
  Top 0.203: IC7.2 33.78,103.12 35.31,104.65 38.76,104.65 43.33,109.22 43.33,117.09 42.32,118.11 IC3.11
N$18
  Top 0.203: IC2.2 66.04,113.08 67.06,113.08 73.61,119.63 77.21,119.63 77.83,120.25 77.83,121.05 77.26,121.61 68.48,121.61 66.9,123.19 IC2.6
N$19
  Top 0.203: IC3.3 47.24,115.57 46.63,114.96 46.63,92.91 39.01,85.29 39.01,81.79 38.43,81.2 32.85,81.2 31.8,82.25 31.8,92.66 31.24,93.22 IC7.12
N$20
  Top 0.203: IC4.6 29.46,123.19 27.94,121.67 21.85,121.67 21.23,121.05 21.23,120.25 21.85,119.63 23.37,119.63 29.97,113.03 IC4.2
N$21
  Top 0.203: IC1.12 76.66,115.57 78.49,117.4 78.49,124 76.76,125.73 IC1.8
N$22
  Top 0.203: IC2.3 66.04,115.52 65.02,115.52 62.59,113.08 62.59,108.46 70.31,100.74 70.31,96.47 66.8,92.96 IC6.8
N$23
  Top 0.203: IC6.6 69.34,101.04 61.98,108.41 61.98,116.69 60.55,118.11 IC2.11
N$24
  Top 0.203: IC6.10 76,96.06 76,101.91 82.04,107.95 82.04,113.79 IC1.3
N$25
  Top 0.203: V1.2 55.02,87.78 75.34,87.78 IC6.13
N$26
  Top 0.203: IC6.3 76.96,95.25 75.69,93.98 75.69,90.93 72.95,88.19 52.88,88.19 V1.3
N$27
  Top 0.203: V1.4 45.47,84.07 47.12,85.72 47.15,85.75 49.99,88.59 71.07,88.59 IC6.11
N$28
  Top 0.203: V1.5 42.93,84.07 48.26,89.41 68.83,89.41 70.31,90.88 70.31,94.18 71.88,95.76 IC6.5
N$29
  Top 0.203: V1.6 40.39,84.33 45.87,89.81 67.21,89.81 IC6.9
N$30
  Top 0.203: IC7.1 36.32,100.23 34.8,98.7 34.8,87.12 37.85,84.07 V1.7
N$31
  Top 0.203: IC7.13 34.19,93.83 34.19,85.19 35.31,84.07 V1.8
N$32
  Top 0.203: IC4.8 22.1,125.73 20.73,124.36 20.73,117.35 22.5,115.57 IC4.12
N$33
  Top 0.203: IC5.8 5.89,125.73 8.89,122.73 8.89,121.87 11.07,119.69 13.92,119.69 14.99,118.62 14.99,117.35 14.22,116.59 8.64,116.59 6.15,119.07 3.96,119.07 3.45,118.57 3.45,116.74 4.62,115.57 IC5.12
N$34
  Top 0.203: V1.11 27.18,83.82 27.18,97.79 26.16,98.81 IC7.5
N$35
  Top 0.203: IC7.9 23.57,94.18 23.57,77.27 V1.13
N$37
  Top 0.203: R1.1 96.32,128.73 96.32,125.27 IC9.9
N$38
  Top 0.203: R1.2 95.5,144.78 Q1.2
N$39
  Top 0.203: R2.2 101.8,146 101.8,146.63 Q2.2
N$40
  Top 0.203: R2.1 99.77,130.35 99.77,122.43 101.55,120.65 IC9.5
N$41
  Top 0.203: R3.1 76.2,129.54 74.17,127.51 74.17,124.26 75.08,123.34 75.18,123.24 75.23,123.19 IC1.9
N$42
  Top 0.203: Q3.2 76.2,145.41 R3.2
N$43
  Top 0.203: R4.2 83.11,144.83 83.11,145.97 Q4.2
N$44
  Top 0.203: IC1.5 83.46,120.65 81.53,122.58 81.53,130.56 R4.1
N$45
  Top 0.203: R5.1 60.81,128.42 60.81,125.07 58.93,123.19 IC2.9
N$46
  Top 0.203: Q5.2 59.69,144.78 R5.2
N$47
  Top 0.203: Q6.2 66.04,145.29 R6.2
N$48
  Top 0.203: R6.1 63.75,130.3 63.75,122.94 IC2.5
N$49
  Top 0.203: R7.1 40.64,129.54 38.35,127.25 38.35,124.51 39.62,123.24 40.64,123.24 IC3.9
N$50
  Top 0.203: Q7.2 40.64,145.41 R7.2
N$51
  Top 0.203: Q8.2 48.26,146.3 R8.2
N$52
  Top 0.203: R8.1 45.52,130.76 45.52,122.63 47.5,120.65 IC3.5
N$53
  Top 0.203: IC4.9 23.62,123.19 25.4,124.97 25.4,128.27 R9.1
N$54
  Top 0.203: Q9.2 24.13,144.78 R9.2
N$55
  Top 0.203: Q10.2 30.48,145.8 R10.2
N$56
  Top 0.203: IC4.5 30.99,120.65 33.48,123.14 33.48,126.8 29.46,130.81 R10.1
N$57
  Top 0.203: R11.1 5.08,129.54 3.05,127.51 3.05,124.26 4.12,123.19 IC5.9
N$58
  Top 0.203: Q11.2 5.08,145.41 R11.2
N$59
  Top 0.203: R12.2 11.99,144.83 11.99,145.97 Q12.2
N$60
  Top 0.203: R12.1 10.31,130.45 10.31,122.02 11.68,120.65 IC5.5
N$61
  Top 0.203: OK1.1 R19.2
N$62
  Top 0.203: 82.3,24.69 77.88,29.11 52.98,29.11 OK1.4 | 82.3,24.69 87.38,24.69 R20.1 | 82.3,24.69 R21.2
N$63
  Top 0.203: T2.2 78.74,76.33 R40.1
N$64
  Top 0.203: OK6.4 54.25,40.13 62.99,31.39 93.83,31.39 R35.1 R36.2
N$65
  Top 0.203: R31.1 R32.2 60.45,24.38 51.82,24.38 50.6,25.6 50.6,49.58 OK5.4
N$66
  Top 0.203: R30.2 R29.1 64.26,28.7 59.28,28.7 58.12,27.53 52.07,27.53 51,28.6 51,41.55 55.47,46.02 55.47,59.94 53.7,61.72 OK4.4
N$67
  Top 0.203: R26.1 R27.2 55.12,8.89 OK3.4
N$68
  Top 0.203: OK2.4 56.79,22.76 66.7,22.76 68.73,24.79 68.73,26.98 70.31,28.55 75.84,28.55 R22.1 R23.2
N$69
  Top 0.203: OK2.1 R24.2
N$70
  Top 0.203: T1.2 83.31,81.41 R38.1
N$71
  Top 0.203: OK3.1 R25.2
N$73
  Top 0.203: T3.2 83.44,65.02 R42.1
N$74
  Top 0.203: R28.2 OK4.1
N$75
  Top 0.203: T4.2 R44.1
N$76
  Top 0.203: OK5.1 R33.2
N$77
  Top 0.203: T5.2 R46.1
N$78
  Top 0.203: OK6.1 R34.2
N$79
  Top 0.203: R48.1 86.77,54.97 83.29,54.97 T6.2
N$82
  Top 0.203: IC7.3 31.24,101.09 32.31,100.03 32.31,83.77 V1.9
S/R1
  Top 0.203: Q1.1 94.28,148.64 94.28,155.14 93.04,156.38 X3.3
S/R2
  Top 0.203: X4.3 76.2,156.31 Q3.1
S/R3
  Top 0.203: X5.3 58.42,156.31 Q5.1
S/R4
  Top 0.203: X6.3 40.64,156.31 Q7.1
S/R5
  Top 0.203: X7.3 22.86,156.31 Q9.1
S/R6
  Top 0.203: X8.3 5.08,156.31 Q11.1